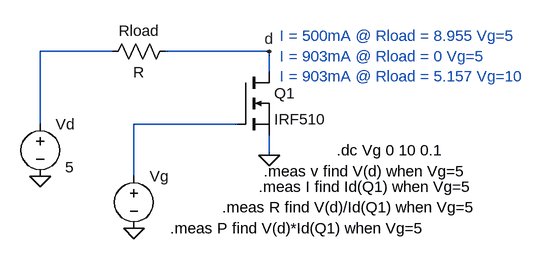
[diagram p0: schematic nmos.asc]
nmos.asc, the LTspice schematic file:
Version 4
SHEET 1 880 680
WIRE 128 112 16 112
WIRE 368 112 208 112
WIRE 368 144 368 112
WIRE 16 224 16 112
WIRE 320 224 160 224
WIRE 368 272 368 240
WIRE 160 304 160 224
FLAG 368 272 0
FLAG 16 304 0
FLAG 160 384 0
FLAG 368 112 d
SYMBOL Voltage 16 208 R0
WINDOW 3 38 82 Left 2
SYMATTR Value 5
SYMATTR InstName Vd
SYMBOL Voltage 160 288 R0
SYMATTR InstName Vg
SYMATTR Value ""
SYMBOL nmos 320 144 R0
SYMATTR InstName Q1
SYMATTR Value IRF510
SYMBOL Res 224 96 R90
WINDOW 0 0 56 VBottom 2
WINDOW 3 32 56 VTop 2
SYMATTR InstName Rload
TEXT 472 264 Left 2 !.dc Vg 0 10 0.1
TEXT 296 352 Left 2 !.meas R find V(d)/Id(Q1) when Vg=5
TEXT 216 384 Left 2 !.meas P find V(d)*Id(Q1) when Vg=5
TEXT 352 320 Left 2 !.meas I find Id(Q1) when Vg=5
TEXT 360 296 Left 2 !.meas v find V(d) when Vg=5
TEXT 384 88 Left 2 ;I = 500mA @ Rload = 8.955 Vg=5\nI = 903mA @ Rload = 0 Vg=5\nI = 903mA @ Rload = 5.157 Vg=10

The netlist it stands for:
* nmos.asc
Vd N001 0 5
Vg N002 0
M§Q1 d N002 0 0 IRF510
Rload d N001 R
.model NMOS NMOS
.model PMOS PMOS
.lib standard.mos
.dc Vg 0 10 0.1
.meas R find V(d)/Id(Q1) when Vg=5
.meas P find V(d)*Id(Q1) when Vg=5
.meas I find Id(Q1) when Vg=5
.meas v find V(d) when Vg=5
* I = 500mA @ Rload = 8.955 Vg=5
* I = 903mA @ Rload = 0 Vg=5
* I = 903mA @ Rload = 5.157 Vg=10
.backanno
.end